# Altium schematic sheet SHDN-CURRENT-S13-V00-ShutdownRelay.SchDoc: Shutdown Loop Relay
size A3; DrawnBy: Jonn DIllon; DocumentNumber: 13; SheetNumber: 13; SheetTotal: 14; Project: Shutdown Current Board 2020
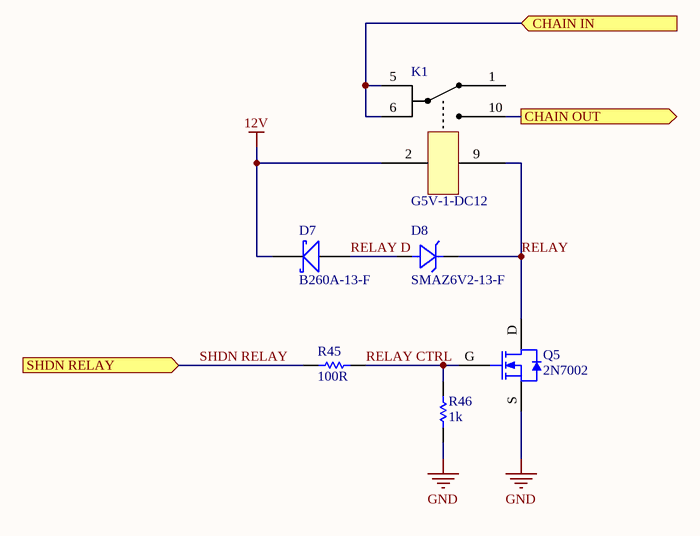
[diagram p0: SHDN-CURRENT-S13-V00-ShutdownRelay.SchDoc]

## Parts
D7  B260A-13-F  [SMA]
D8  SMAZ6V2-13-F  [SMA]
K1  G5V-1-DC12  [G5V-1]
Q5  2N7002  [SOT23-3]
R45  100R  [Res_ThinFilm_0603]
R46  1k  [Res_ThinFilm_0603]

## Ports
CHAIN IN (in), CHAIN OUT (out), SHDN RELAY (in)

## Nets
12V: D7.K K1.2
GND: Q5.S R46.1
CHAIN IN: K1.5 K1.6 ; port CHAIN IN
CHAIN OUT: K1.10 ; port CHAIN OUT
RELAY: D8.K(Cathode) K1.9 Q5.D
RELAY CTRL: Q5.G R45.2 R46.2
RELAY D: D7.A D8.A(Anode)
SHDN RELAY: R45.1 ; port SHDN RELAY

Not connected (* = marked no-connect by the designer): K1 1

## Notes on the sheet
- Revision History:
- Sheet Title:
- Rev
- Date
- Description
- Project:
- Size:
- Drawn By:
- A3
- Number:
- Revision:
- Sheet
- Version:
- of
- QUT Motorsport
- O-120, Gardens Point
- 2 George Street
- Brisbane, QLD 4000
- Australia
- Print Date:
- Print Time:
- File Name:

## Library data of the parts
D7 = B260A-13-F: Diode, Schottky Barrier Rectifier, 60 V, 2 A, B260A-13-F
D8 = SMAZ6V2-13-F: Zener Diode 6.2V 1W ±5% Surface Mount SMA; Manufacturer: Generic; MPN: 5V6 500mW SMA
K1 = G5V-1-DC12: General Purpose Relay SPDT (1 Form C) Through Hole, 12V, 2A
R45 = 100R 5%, 0603: Resistor, SMD, 100R, 0.1W, 5%, 0603
R46 = 1k 5% 0603: Resistor, SMD, 1k, 0.1W, 5%, 0603